# Altium project 1924B_MiniBoiteNoire.PrjPcb
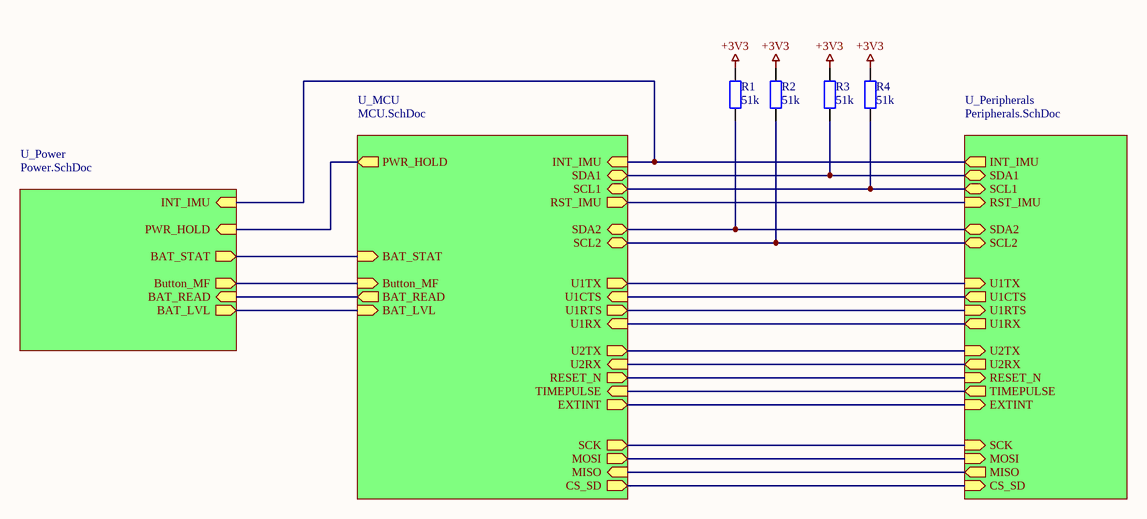
[diagram p0: SchemaBloc.SchDoc]
4 sheets, 111 parts. Net scope: hierarchical (ports join the sheet entries above them; power ports are global).
Board file: ES_Class6C_2L.PcbDoc
Sheets:
  SchemaBloc.SchDoc
    U_MCU = MCU.SchDoc
    U_Power = Power.SchDoc
    U_Peripherals = Peripherals.SchDoc

## Sheet SchemaBloc.SchDoc
size A3; Date: 26.01.2022; Author: Ali Zoubir; CompanyName: ETML-ES; DrawnBy: Ali Zoubir; Engineer: Ali Zoubir; Organization: ETML-ES; Address1: Avenue Recordon 1; Address2: 1004 Lausanne; Address3: Switzerland; Revision: 1924B; SheetNumber: 1; SheetTotal: 4; Version: V0

### Parts
R1  51k  [RES_0805]
R2  51k  [RES_0805]
R3  51k  [RES_0805]
R4  51k  [RES_0805]

### Sub-sheets
U_MCU = MCU.SchDoc: SDA1 (bidir), SCL1 (bidir), CS_SD (out), BAT_STAT (in), RST_IMU (out), INT_IMU (in), PWR_HOLD (out), SDA2 (bidir), SCL2 (bidir), U1TX (out), U1RX (in), MISO (in), MOSI (out), SCK (out), Button_MF (in), BAT_LVL (in), BAT_READ (out), U2TX (out), U1CTS (in), U1RTS (out), U2RX (in), RESET_N (out), EXTINT (out), TIMEPULSE (in)
U_Peripherals = Peripherals.SchDoc: SDA1 (bidir), SCL1 (bidir), RST_IMU (in), INT_IMU (out), U1TX (in), U1CTS (out), U1RTS (in), U1RX (out), SCL2 (bidir), SDA2 (bidir), SCK (in), MOSI (in), MISO (out), CS_SD (in), U2RX (out), U2TX (in), RESET_N (in), EXTINT (in), TIMEPULSE (out)
U_Power = Power.SchDoc: BAT_STAT (out), Button_MF (out), BAT_READ (in), BAT_LVL (out), INT_IMU (in), PWR_HOLD (in)

### Nets
+3V3: R1.2 R2.2 R3.2 R4.2
BAT_LVL: sheet U_MCU/BAT_LVL, sheet U_Power/BAT_LVL
BAT_READ: sheet U_MCU/BAT_READ, sheet U_Power/BAT_READ
BAT_STAT: sheet U_MCU/BAT_STAT, sheet U_Power/BAT_STAT
Button_MF: sheet U_MCU/Button_MF, sheet U_Power/Button_MF
CS_SD: sheet U_MCU/CS_SD, sheet U_Peripherals/CS_SD
EXTINT: sheet U_MCU/EXTINT, sheet U_Peripherals/EXTINT
INT_IMU: sheet U_MCU/INT_IMU, sheet U_Power/INT_IMU, sheet U_Peripherals/INT_IMU
MISO: sheet U_MCU/MISO, sheet U_Peripherals/MISO
MOSI: sheet U_MCU/MOSI, sheet U_Peripherals/MOSI
PWR_HOLD: sheet U_MCU/PWR_HOLD, sheet U_Power/PWR_HOLD
RESET_N: sheet U_MCU/RESET_N, sheet U_Peripherals/RESET_N
RST_IMU: sheet U_MCU/RST_IMU, sheet U_Peripherals/RST_IMU
SCK: sheet U_MCU/SCK, sheet U_Peripherals/SCK
SCL1: R4.1 ; sheet U_MCU/SCL1, sheet U_Peripherals/SCL1
SCL2: R2.1 ; sheet U_MCU/SCL2, sheet U_Peripherals/SCL2
SDA1: R3.1 ; sheet U_MCU/SDA1, sheet U_Peripherals/SDA1
SDA2: R1.1 ; sheet U_MCU/SDA2, sheet U_Peripherals/SDA2
TIMEPULSE: sheet U_MCU/TIMEPULSE, sheet U_Peripherals/TIMEPULSE
U1CTS: sheet U_MCU/U1CTS, sheet U_Peripherals/U1CTS
U1RTS: sheet U_MCU/U1RTS, sheet U_Peripherals/U1RTS
U1RX: sheet U_MCU/U1RX, sheet U_Peripherals/U1RX
U1TX: sheet U_MCU/U1TX, sheet U_Peripherals/U1TX
U2RX: sheet U_MCU/U2RX, sheet U_Peripherals/U2RX
U2TX: sheet U_MCU/U2TX, sheet U_Peripherals/U2TX

### Notes on the sheet
- Fichier :
- a
- Date :
- Heure :
- Version :
- Auteur :
- Modif.
- b
- c
- d
- Projet :
- No :
- Nb feuilles
- Feuille n°
- Chemin :

### Library data of the parts
R1-R4 = Res2: Res 0805; Value: 1k; Published: 8-Jun-2000; LatestRevisionDate: 17-Jul-2002; LatestRevisionNote: Re-released for DXP Platform.; PackageReference: AXIAL-0.4; Publisher: Altium Limited; PackageDescription: Axial Device, Thru-Hole; 2 Leads; 0.4 in Pin Spacing

## Sheet MCU.SchDoc
size A3; Author: Ali Zoubir; Organization: ETML-ES; Address1: Avenue Recordon 1; Address2: 1004 Lausanne; Address3: Switzerland; Revision: 1924B; SheetNumber: 2; SheetTotal: 4; SPICEModelCacheGNAZWADN: <root> / <DocumentId>GNAZWADN</DocumentId> / </root>; Version: V0
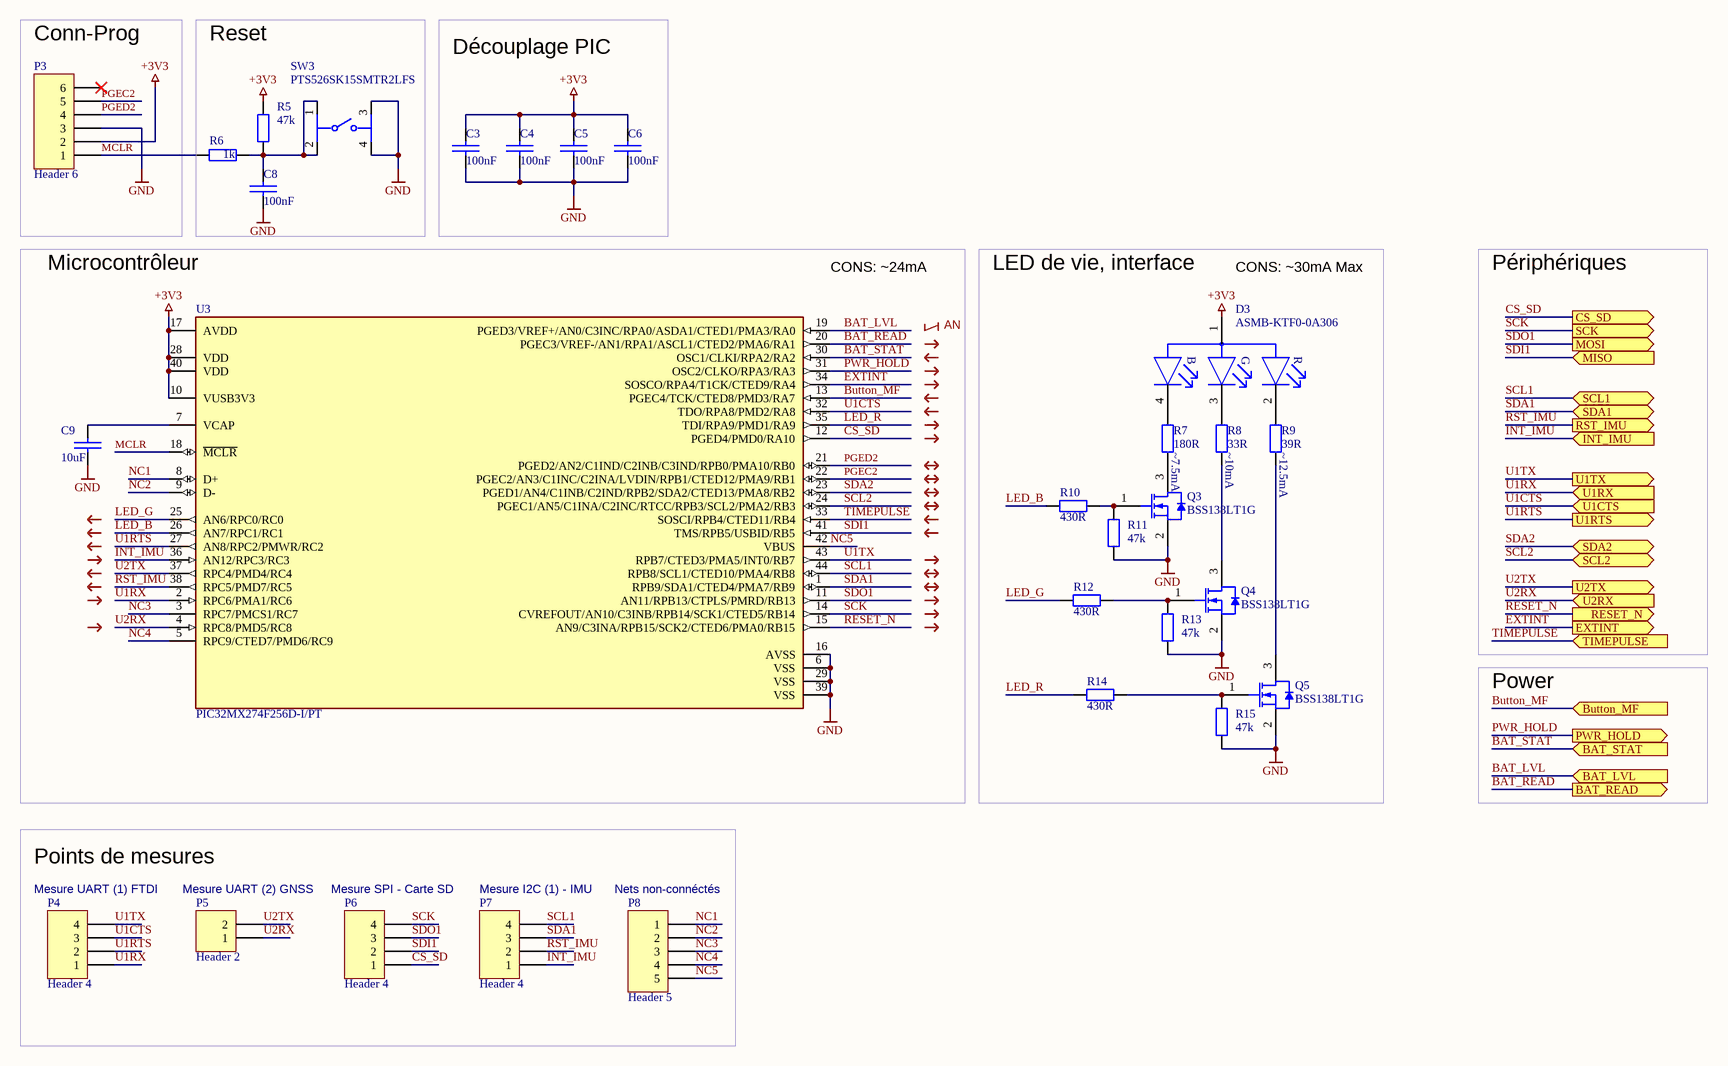
[diagram p1: MCU.SchDoc]

### Parts
C3  100nF  [Cap_0805]
C4  100nF  [Cap_0805]
C5  100nF  [Cap_0805]
C6  100nF  [Cap_0805]
C8  100nF  [Cap_0805]
C9  10uF  [Cap_0805]
D3  ASMB-KTF0-0A306  [FP-PLCC-4-MFG]
P3  Header 6  [HDR1X6]
P4  Header 4  [HDR1X4]
P5  Header 2  [HDR1X2]
P6  Header 4  [HDR1X4]
P7  Header 4  [HDR1X4]
P8  Header 5  [HDR1X5]
Q3  BSS138LT1G  [ONSC-SOT-23-3-318-08_V]
Q4  BSS138LT1G  [ONSC-SOT-23-3-318-08_V]
Q5  BSS138LT1G  [ONSC-SOT-23-3-318-08_V]
R5  47k  [RES_0805]
R6  1k  [RES_0805]
R7  value 180R  [RES_0805]  (hidden comment: 430R)
R8  value 33R  [RES_0805]  (hidden comment: 430R)
R9  value 39R  [RES_0805]  (hidden comment: 430R)
R10  430R  [RES_0805]
R11  value 47k  [RES_0805]  (hidden comment: 10k)
R12  430R  [RES_0805]
R13  value 47k  [RES_0805]  (hidden comment: 10k)
R14  430R  [RES_0805]
R15  value 47k  [RES_0805]  (hidden comment: 10k)
SW3  PTS526SK15SMTR2LFS  [FP-PTS526SK15SMTR2LFS-MFG]
U3  PIC32MX274F256D-I/PT  [FP-C04-076-IPC_A]

### Blocks framed on the sheet
Conn-Prog: P3
Reset: C8 R5 R6 SW3
Découplage PIC: C3-C6
Microcontrôleur: C9 U3
LED de vie, interface: D3 Q3-Q5 R7-R15
Points de mesures: P4-P8

### Ports
BAT_LVL (in), BAT_READ (out), BAT_STAT (in), Button_MF (in), CS_SD (out), EXTINT (out), INT_IMU (in), MISO (in), MOSI (out), PWR_HOLD (out), RESET_N (out), RST_IMU (out), SCK (out), SCL1 (bidir), SCL2 (bidir), SDA1 (bidir), SDA2 (bidir), TIMEPULSE (in), U1CTS (in), U1RTS (out), U1RX (in), U1TX (out), U2RX (in), U2TX (out)

### Nets
+3V3: C3.1 C4.1 C5.1 C6.1 D3.1(A) P3.2 R5.1 U3.10(VUSB3V3) U3.17(AVDD) U3.28(VDD) U3.40(VDD)
GND: C3.2 C4.2 C5.2 C6.2 C8.2 C9.2 P3.3 Q3.2(S) Q4.2(S) Q5.2(S) R11.1 R13.1 R15.1 SW3.3 SW3.4 U3.6(VSS) U3.16(AVSS) U3.29(VSS) U3.39(VSS)
BAT_LVL: U3.19(PGED3/VREF+/AN0/C3INC/RPA0/ASDA1/CTED1/PMA3/RA0) ; port BAT_LVL
BAT_READ: U3.20(PGEC3/VREF-/AN1/RPA1/ASCL1/CTED2/PMA6/RA1) ; port BAT_READ
BAT_STAT: U3.30(OSC1/CLKI/RPA2/RA2) ; port BAT_STAT
Button_MF: U3.13(PGEC4/TCK/CTED8/PMD3/RA7) ; port Button_MF
CS_SD: P6.1 U3.12(PGED4/PMD0/RA10) ; port CS_SD
EXTINT: U3.34(SOSCO/RPA4/T1CK/CTED9/RA4) ; port EXTINT
INT_IMU: P7.1 U3.36(AN12/RPC3/RC3) ; port INT_IMU
LED_B: R10.2 U3.26(AN7/RPC1/RC1)
LED_G: R12.2 U3.25(AN6/RPC0/RC0)
LED_R: R14.2 U3.35(TDI/RPA9/PMD1/RA9)
MCLR: P3.1 R6.1 U3.18(~{MCLR})
NC1: P8.1 U3.8(D+)
NC2: P8.2 U3.9(D-)
NC3: P8.3 U3.3(RPC7/PMCS1/RC7)
NC4: P8.4 U3.5(RPC9/CTED7/PMD6/RC9)
NC5: P8.5 U3.42(VBUS)
PGEC2: P3.5 U3.22(PGEC2/AN3/C1INC/C2INA/LVDIN/RPB1/CTED12/PMA9/RB1)
PGED2: P3.4 U3.21(PGED2/AN2/C1IND/C2INB/C3IND/RPB0/PMA10/RB0)
PWR_HOLD: U3.31(OSC2/CLKO/RPA3/RA3) ; port PWR_HOLD
RESET_N: U3.15(AN9/C3INA/RPB15/SCK2/CTED6/PMA0/RB15) ; port RESET_N
RST_IMU: P7.2 U3.38(RPC5/PMD7/RC5) ; port RST_IMU
SCK: P6.4 U3.14(CVREFOUT/AN10/C3INB/RPB14/SCK1/CTED5/RB14) ; port SCK
SCL1: P7.4 U3.44(RPB8/SCL1/CTED10/PMA4/RB8) ; port SCL1
SCL2: U3.24(PGEC1/AN5/C1INA/C2INC/RTCC/RPB3/SCL2/PMA2/RB3) ; port SCL2
SDA1: P7.3 U3.1(RPB9/SDA1/CTED4/PMA7/RB9) ; port SDA1
SDA2: U3.23(PGED1/AN4/C1INB/C2IND/RPB2/SDA2/CTED13/PMA8/RB2) ; port SDA2
SDI1: P6.2 U3.41(TMS/RPB5/USBID/RB5) ; port MISO  [project net MISO]
SDO1: P6.3 U3.11(AN11/RPB13/CTPLS/PMRD/RB13) ; port MOSI  [project net MOSI]
TIMEPULSE: U3.33(SOSCI/RPB4/CTED11/RB4) ; port TIMEPULSE
U1CTS: P4.3 U3.32(TDO/RPA8/PMD2/RA8) ; port U1CTS
U1RTS: P4.2 U3.27(AN8/RPC2/PMWR/RC2) ; port U1RTS
U1RX: P4.1 U3.2(RPC6/PMA1/RC6) ; port U1RX
U1TX: P4.4 U3.43(RPB7/CTED3/PMA5/INT0/RB7) ; port U1TX
U2RX: P5.1 U3.4(RPC8/PMD5/RC8) ; port U2RX
U2TX: P5.2 U3.37(RPC4/PMD4/RC4) ; port U2TX
NetC8_1: C8.1 R5.2 R6.2 SW3.1 SW3.2
NetC9_1: C9.1 U3.7(VCAP)
NetD3_2: D3.2(Red_C) R9.1
NetD3_3: D3.3(Green_C) R8.1
NetD3_4: D3.4(Blue_C) R7.1
NetQ3_1: Q3.1(G) R10.1 R11.2
NetQ3_3: Q3.3(D) R7.2
NetQ4_1: Q4.1(G) R12.1 R13.2
NetQ4_3: Q4.3(D) R8.2
NetQ5_1: Q5.1(G) R14.1 R15.2
NetQ5_3: Q5.3(D) R9.2

Not connected (* = marked no-connect by the designer): P3 6*

### Notes on the sheet
- CONS: ~24mA
- CONS: ~30mA Max
- Périphériques
- AN
- ~7.5mA
- (near R8) ~10mA
- (near R9) ~12.5mA
- Power
- (near P4) Mesure UART (1) FTDI
- (near P5) Mesure UART (2) GNSS
- (near P6) Mesure SPI - Carte SD
- (near P7) Mesure I2C (1) - IMU
- (near P8) Nets non-connéctés
- Fichier :
- a
- Date :
- Heure :
- Version :
- Auteur :
- Modif.
- b
- c
- d
- Projet :
- No :
- Nb feuilles
- Feuille n°
- Chemin :
- (in symbol CMP-18399-000003-1) B; G; R

### Library data of the parts
C3-C6 C8 C9 = C: SDTSourceLibName: C:\WINDOWS\TEMP\DA.LIB; PCB Footprint: RC0805
D3 = CMP-18399-000003-1: LED RGB 4PLCC SMD; Manufacturer: Broadcom; Peak Emmision Wavelength: 467/518/628nm; Luminous Intensity: 215/1100/490mcd; Power Dissipation: 66/66/48mW; Led Orientation: Top View; Colour: Blue, Green, Red; Wavelength: 471/524/620nm; Forward Current: 10/15/15mA; Reverse Voltage: 4V; Viewing Angle: 110°; Forward Voltage: 2.85/2.95/2V; Max Junction Temp: +100°C; Digikey Description: LED RGB 4PLCC SMD; ComponentLink2URL: https://docs.broadcom.com/docs/ASMB-KTF0-0A306-DS100; ComponentLink2Description: Datasheet; Manufacturer Part Number: ASMB-KTF0-0A306; Temperature Range Low: -40°C; Device Class L2: LEDs; RoHS: TRUE; Octopart: https://octopart.com/asmb-ktf0-0a306-broadcom-87157377; Package: PLCC-4; Mouser Description: LED Multi-Color Chip Red/Green/Blue 620nm/524nm/471nm 20mA 4-Pin PLCC T/R; Category: Diode; Lead Free: Yes; Height: 2.1mm; Temperature: -40°C to +85°C; Device Class L1: Optoelectronics; Automotive: No; Temperature Range High: +85°C; Device Class L3: unset
P3 = Header 6: Header, 6-Pin; LatestRevisionDate: 17-Jul-2002; LatestRevisionNote: Re-released for DXP Platform.; Publisher: Altium Limited
P4 P6 P7 = Header 4: Header, 4-Pin; LatestRevisionDate: 17-Jul-2002; LatestRevisionNote: Re-released for DXP Platform.; Publisher: Altium Limited
P5 = Header 2: Header, 2-Pin; LatestRevisionDate: 17-Jul-2002; LatestRevisionNote: Re-released for DXP Platform.; Publisher: Altium Limited
P8 = Header 5: Header, 5-Pin; LatestRevisionDate: 17-Jul-2002; LatestRevisionNote: Re-released for DXP Platform.; Publisher: Altium Limited
Q3-Q5 = CMP-1058-00767-1: Power MOSFET, 200 mA, 50 V, N-Channel, 3-Pin SOT-23, Pb-Free, Tape and Reel; Manufacturer: On Semiconductor; PD Max (W): 0.225; Coss Typ (pF): 12; V(BR)DSS Min (V): 50; VGS Max (V): 20; Channel Polarity: N Channel; Configuration: Single; VGS(th) Max (V): 1.5; Ciss Typ (pF): 40; Crss Typ (pF): 3.5; ID Max (A): 0.2; ComponentLink3Description: Package Specification; PackageDescription: 3-Pin Small Outline Transistor, Body 2.92 x 1.3 mm, Pitch 0.95 mm; PackageReference: SOT-23-3-318-08; RoHS: Pb-Free; Mounting Technology: Surface Mount; ComponentLink1Description: Manufacturer URL; ComponentLink2URL: http://www.onsemi.com/pub_link/Collateral/BSS138LT1-D.PDF; ComponentLink2Description: Datasheet; Packing: Tape and Reel; PackageVersion: Rev. AP, 11/2009; PartNumber: BSS138LT1G; Package Type: SOT-23-3; ComponentLink1URL: http://www.onsemi.com/; DatasheetVersion: Rev. 8; ComponentLink3URL: http://www.onsemi.cn/pub_link/Collateral/318-08.PDF
R5 = Res2: Res 0805; Value: 1K; Published: 8-Jun-2000; LatestRevisionDate: 17-Jul-2002; LatestRevisionNote: Re-released for DXP Platform.; PackageReference: AXIAL-0.4; Publisher: Altium Limited; PackageDescription: Axial Device, Thru-Hole; 2 Leads; 0.4 in Pin Spacing
R6-R15 = Res2: Res 0805; Published: 8-Jun-2000; LatestRevisionDate: 17-Jul-2002; LatestRevisionNote: Re-released for DXP Platform.; PackageReference: AXIAL-0.4; Publisher: Altium Limited; PackageDescription: Axial Device, Thru-Hole; 2 Leads; 0.4 in Pin Spacing
  R6: Value: 1K
  R10 R12 R14: Value: 430R
SW3 = CMP-10040-000013-1: TACT 5.2 X 5.2, 1.5 MM H, 260GF,; Manufacturer: C&K; Operating Force: 250gf; Throw Configuration: SPST-NO; Contact Current Rating: 50mA; Standoff Height: 0mm; Contact Resistance: 100mΩ; Voltage Rating Dc: 12V; Electromechanical Life: 200000Cycles; Device Class L3: Tactile Switches; Device Class L2: Switches; Temperature: -20°C to +70°C; Temperature Range Low: -20°C; Package: PTS526SK15SMTR2LFS; Temperature Range High: +70°C; ComponentLink2Description: Datasheet; Device Class L1: Electromechanical; Height: 1.65mm; Digikey Description: TACT 5.2 X 5.2, 1.5 MM H, 260GF,; Category: Switch; RoHS: TRUE; Automotive: No; Lead Free: Yes; Manufacturer Part Number: PTS526SK15SMTR2LFS; Octopart: https://octopart.com/pts526+sk15+smtr2+lfs-c%26k+components-100617999; ComponentLink2URL: https://www.ckswitches.com/media/2780/pts526.pdf
U3 = CMP-06276-000357-1: IC MCU 32BIT 256KB FLASH 44TQFP

## Sheet Power.SchDoc
size A3; Author: Ali Zoubir; Organization: ETML-ES; Address1: Avenue Recordon 1; Address2: 1004 Lausanne; Address3: Switzerland; Revision: 1924B; SheetNumber: 4; SheetTotal: 4; Version: V0
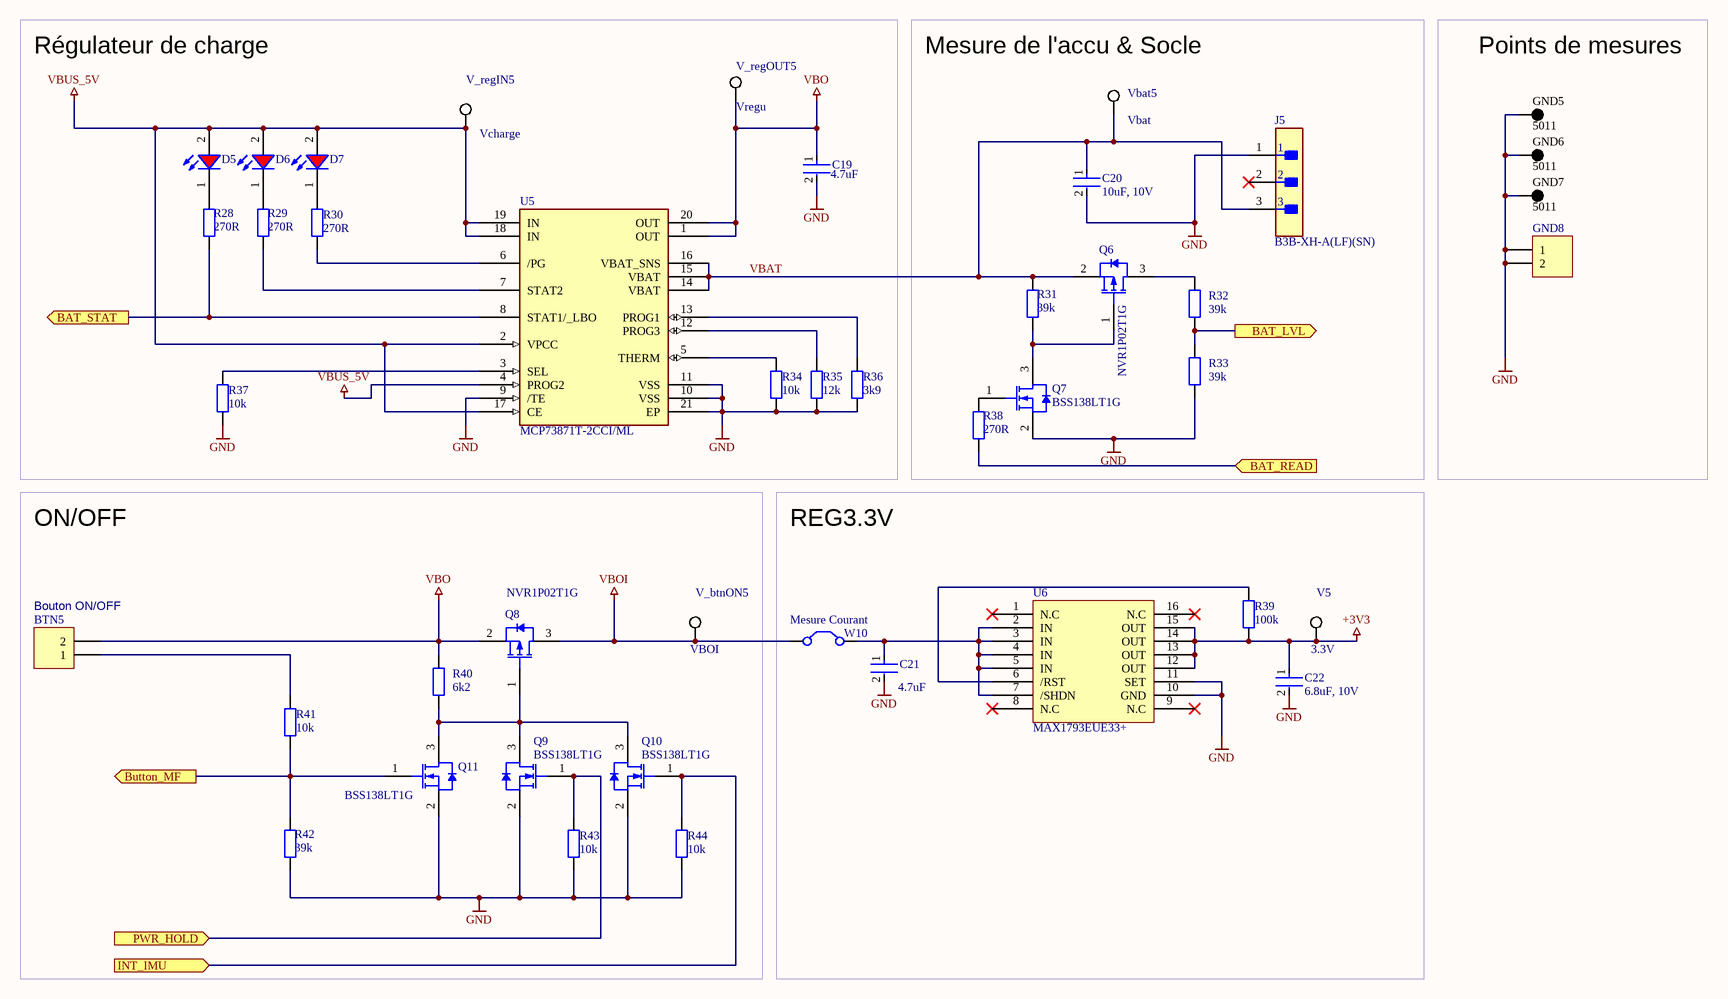
[diagram p2: Power.SchDoc]

### Parts
BTN5  Button connector  [HDR1X2]  (value not drawn)
C19  Capacitance: 4.7uF  [Cap_0805]  (hidden comment: 4.7uF, 35V)
C20  10uF, 10V  [Cap_0805]
C21  Capacitance: 4.7uF  [Cap_0805]  (hidden comment: 4.7uF, 35V)
C22  6.8uF, 10V  [Cap_0805]
D5  Super Red, 1.9 V  [WL-SMCW_0805_150080xx75000]  (value not drawn)
D6  Super Red, 1.9 V  [WL-SMCW_0805_150080xx75000]  (value not drawn)
D7  Super Red, 1.9 V  [WL-SMCW_0805_150080xx75000]  (value not drawn)
GND5  5011  [KSTN-5011_V]
GND6  5011  [KSTN-5011_V]
GND7  5011  [KSTN-5011_V]
GND8  Header 2  [HDR1X2]  (value not drawn)
J5  B3B-XH-A(LF)(SN)  [FP-B3B-XH-A_LF_SN-MFG]
Q6  NVR1P02T1G  [ONSC-SOT-23-3-318-08_V]
Q7  BSS138LT1G  [ONSC-SOT-23-3-318-08_V]
Q8  NVR1P02T1G  [ONSC-SOT-23-3-318-08_V]
Q9  BSS138LT1G  [ONSC-SOT-23-3-318-08_V]
Q10  BSS138LT1G  [ONSC-SOT-23-3-318-08_V]
Q11  BSS138LT1G  [ONSC-SOT-23-3-318-08_V]
R28  270R  [RES_0805]
R29  270R  [RES_0805]
R30  270R  [RES_0805]
R31  39k  [RES_0805]
R32  39k  [RES_0805]
R33  39k  [RES_0805]
R34  10k  [RES_0805]
R35  12k  [RES_0805]
R36  3k9  [RES_0805]
R37  10k  [RES_0805]
R38  270R  [RES_0805]
R39  100k  [RES_0805]
R40  6k2  [RES_0805]
R41  10k  [RES_0805]
R42  39k  [RES_0805]
R43  10k  [RES_0805]
R44  10k  [RES_0805]
U5  MCP73871T-2CCI/ML  [Microchip_C04-126_IPC_B]
U6  MAX1793EUE33+  [TSOP65P640X110_HS-17N]
V5  3.3V  [KSTN-5019_V]
V_btnON5  VBOI  [KSTN-5019_V]
V_regIN5  Vcharge  [KSTN-5019_V]
V_regOUT5  Vregu  [KSTN-5019_V]
Vbat5  Vbat  [KSTN-5019_V]
W10  Jumper  [JUMPER]  (value not drawn)

### Blocks framed on the sheet
Régulateur de charge: C19 D5-D7 R28-R30 R34-R37 U5 V_regIN5 V_regOUT5
Mesure de l'accu & Socle: C20 J5 Q6 Q7 R31-R33 R38 Vbat5
Points de mesures: GND5-GND8
ON/OFF: BTN5 Q8-Q11 R40-R44 V_btnON5
REG3.3V: C21 C22 R39 U6 V5 W10

### Ports
BAT_LVL (out), BAT_READ (in), BAT_STAT (out), Button_MF (out), INT_IMU (in), PWR_HOLD (in)

### Nets
+3V3: C22.1 R39.1 U6.12(OUT) U6.13(OUT) U6.14(OUT) U6.15(OUT) V5.1
GND: C19.2 C20.2 C21.2 C22.2 GND5.1 GND6.1 GND7.1 GND8.1 GND8.2 J5.1 Q7.2(S) Q9.2(S) Q10.2(S) Q11.2(S) R33.1 R34.1 R35.1 R36.1 R37.1 R42.1 R43.1 R44.1 U5.9(/TE) U5.10(VSS) U5.11(VSS) U5.21(EP) U6.10(GND) U6.11(SET)
VBO: BTN5.2 C19.1 Q8.2(S) R40.2 U5.1(OUT) U5.20(OUT) V_regOUT5.1
VBOI: Q8.3(D) V_btnON5.1 W10.1(C1)
VBUS_5V: D5.2(A) D6.2(A) D7.2(A) U5.2(VPCC) U5.4(PROG2) U5.17(CE) U5.18(IN) U5.19(IN) V_regIN5.1
BAT_LVL: R32.1 R33.2 ; port BAT_LVL
BAT_READ: R38.1 ; port BAT_READ
BAT_STAT: R28.1 U5.8(STAT1/_LBO) ; port BAT_STAT
Button_MF: Q11.1(G) R41.1 R42.2 ; port Button_MF
INT_IMU: Q10.1(G) R44.2 ; port INT_IMU
PWR_HOLD: Q9.1(G) R43.2 ; port PWR_HOLD
VBAT: C20.1 J5.3 Q6.2(S) R31.2 U5.14(VBAT) U5.15(VBAT) U5.16(VBAT_SNS) Vbat5.1
NetBTN5_1: BTN5.1 R41.2
NetC21_1: C21.1 U6.2(IN) U6.3(IN) U6.4(IN) U6.5(IN) U6.7(/SHDN) W10.2(C2)
NetD5_1: D5.1(K) R28.2
NetD6_1: D6.1(K) R29.2
NetD7_1: D7.1(K) R30.1
NetQ6_1: Q6.1(G) Q7.3(D) R31.1
NetQ6_3: Q6.3(D) R32.2
NetQ7_1: Q7.1(G) R38.2
NetQ8_1: Q8.1(G) Q9.3(D) Q10.3(D) Q11.3(D) R40.1
NetR29_1: R29.1 U5.7(STAT2)
NetR30_2: R30.2 U5.6(/PG)
NetR34_2: R34.2 U5.5(THERM)
NetR35_2: R35.2 U5.12(PROG3)
NetR36_2: R36.2 U5.13(PROG1)
NetR37_2: R37.2 U5.3(SEL)
NetR39_2: R39.2 U6.6(/RST)

Not connected (* = marked no-connect by the designer): J5 2*; U6 1(N.C)* 8(N.C)* 9(N.C)* 16(N.C)*

### Notes on the sheet
- (near BTN5) Bouton ON/OFF
- (near W10) Mesure Courant
- Fichier :
- a
- Date :
- Heure :
- Version :
- Auteur :
- Modif.
- b
- c
- d
- Projet :
- No :
- Nb feuilles
- Feuille n°
- Chemin :

### Library data of the parts
BTN5 GND8 = Header 2: Header, 2-Pin; LatestRevisionDate: 17-Jul-2002; LatestRevisionNote: Re-released for DXP Platform.; Publisher: Altium Limited
C19 C21 = CMP-08246-002735-1: Multilayer Ceramic Capacitors 4.7μF ±10% 35V X7R SMD 0805; Tolerance: 10%; Depth: 1.25mm; RoHS Compliant: Yes; Construction: Flat; Radiation Hardening: No; Lead Free: Lead Free; Weight: 0.000194oz; Termination: SMD/SMT; Package Quantity: 2000; Dielectric: X7R; Mount: Surface Mount; Voltage Rating: 35V; Case/Package: 0805; Min Operating Temperature: -55°C; Dielectric Material: Ceramic; REACH SVHC: No SVHC; Series: C; Thickness: 0.057inch; Packaging: Tape and Reel; Case Code (Metric): 2012; Max Operating Temperature: 125°C; Case Code (Imperial): 0805; Height: 1.25mm; Width: 0.049inch; Length: 2mm; Voltage Rating (DC): 35V
C20 = CMP-2007-03243-2: CAP CER 10UF 10V X5R 0805; Manufacturer Part Number: C0805C106K8PACTU; Manufacturer: Kemet; 3DS Part Number: 220-00001; Tolerance: 10%; Temperature Coefficient: 15%; Material: Ceramic; Device Class L2: Capacitors; Device Class L1: Passive Components; ComponentLink2URL: https://content.kemet.com/datasheets/KEM_C1006_X5R_SMD.pdf; Height: 1.4mm; Lead Free: Yes; Digikey Description: CAP CER 10UF 10V X5R 0805; Octopart: https://octopart.com/c0805c106k8pactu-kemet-98697; Capacitance: 10uF; Value: 10uF; Temperature Range Low: -55°C; Temperature: -55°C to +85°C; Automotive: No; Mouser Description: CAP CER 10UF 10V X5R 0805; Ipc Land Pattern Name: CAPC200125X125; Temperature Range High: +85°C; Voltage: 10V; RoHS: TRUE; Device Class L3: Ceramic Capacitors; ComponentLink2Description: Datasheet; Voltage Rating: 10V; Package: C0805C-DG; Temperature Characteristic: X5R; Category: Cap
C22 = CMP-08246-000118-1: Cap Ceramic 6.8uF 10V X5R 20% Pad SMD 0805 +85°C Automotive T/R; Capacitance: 6.8uF; Packaging: Tape and Reel; Package Quantity: 2000; Width: 0.049inch; Voltage Rating (DC): 10V; Case Code (Imperial): 0805; Ratings: AEC-Q200; Min Operating Temperature: -55°C; Tolerance: 20%; Length: 0.079inch; Case/Package: 0805; Thickness: 0.057inch; Weight: 0.000194oz; Voltage Rating: 10V; Dielectric: X5R; Case Code (Metric): 2012; Height: 1.25mm; Max Operating Temperature: 85°C; Mount: Surface Mount
D5-D7 = 150080SS75000: SMT Mono-color Chip LED Waterclear WL-SMCW, size 0805, Super Red, 1.9 V, 140 deg, 60 mcd; Forward Voltage: 1.9 V; Viewing Angle: 140 deg; Peak Wavelength: 645 nm; Dominant Wavelength: 630 nm; Luminous Intensity: 60 mcd; Chip Technology: AlInGaP; ComponentLink1Description: Manufacturer; ComponentLink1URL: http://www.we-online.de; ComponentLink2Description: Datasheet; ComponentLink2URL: https://katalog.we-online.de/led/datasheet/150080SS75000.pdf; Part Number: 150080SS75000; Published Date: November 2018; Publisher: Wurth Elektronik; Size: 0805; Operating Temperature: -40 to 85 degC; Emitting Color: Super Red; Mounting Technology: SMT; Packaging: Tape and Reel; Supplier 1: Digi-Key; Supplier Part Number 1: 732-4985-1-ND; Supplier 2: Distrelec; Supplier Part Number 2: 30008875
GND5-GND7 = CMP-1672-00003-4: Test Point, Black, Through Hole, RoHS, Bulk; Manufacturer: Keystone; ComponentLink2URL: http://www.keyelco.com/product-pdf.cfm?p=1320; Colour: Black; Pins: 1; REACH SVHC: No SVHC; ComponentLink1URL: http://www.keyelco.com/; PackageReference: 5011; Contact Plating: Silver; Package Quantity: 100; Packaging: Bulk; RoHSCompliant: true; Height: 8.12 mm; PackageDescription: 1-Pin Through Hole Device, Dia 3.17 mm; Mount: Through Hole; Mounting Technology: Through Hole; DatasheetVersion: Rev. F, 12/2013; ComponentLink1Description: Manufacturer URL; Contact Material: Bronze; ComponentLink2Description: Datasheet
J5 = CMP-17439-000014-3: CONN HEADER VERT 3POS 2.5MM; Max Voltage Rating (DC): 250V; Number of Positions: 3; Current Rating: 3A; Gender: Male; Wire/Cable Gauge: 22AWG; Contact Resistance: 20mR; Insulation Resistance: 1GR; Insulation Material: Nylon; Contact Plating: Tin; Depth: 5.75mm; Contact Type: Male Pin; Max Operating Temperature: 85°C; Insulation Color: Natural; Voltage Rating (AC): 250V; Color: Natural; Connector Type: Header; Orientation: Straight; Fastening Type: Detent; Housing Color: White; Min Operating Temperature: -25°C; Termination: Solder; Voltage Rating: 250V; Series: XH; Pitch: 2.5mm; Contact Shape: Square; Number of Rows: 1; Lead Free: Lead Free; Packaging: Bulk; Mount: Through Hole; Flammability Rating: UL94 V-0; Max Voltage Rating (AC): 250V; REACH SVHC: No SVHC; Housing Material: Polyamide; Contact Material: Brass; Lead Pitch: 2.5mm; Contact Finish - Mating: TIN; Length: 9.9mm; Max Current Rating: 3A; Number of Contacts: 3
Q6 Q8 = CMP-1058-00745-1: Power MOSFET, -20 V, -1 A, P-Channel, 3-Pin SOT-23, Pb-Free, Tape and Reel; Manufacturer: On Semiconductor; Ciss Typ (pF): 165; Configuration: Single; VGS(th) Max (V): 2.3; Channel Polarity: P Channel; V(BR)DSS Min (V): 20; ID Max (A): 1; Coss Typ (pF): 110; Qrr Typ (nC): 8; Crss Typ (pF): 35; PD Max (W): 0.4; DatasheetVersion: Rev. 7; ComponentLink1Description: Manufacturer URL; PackageReference: SOT-23-3-318-08; ComponentLink2Description: Datasheet; ComponentLink2URL: http://www.onsemi.cn/pub_link/Collateral/NTR1P02T1-D.PDF; Packing: Tape and Reel; Package Type: SOT-23-3; ComponentLink1URL: http://www.onsemi.com/; RoHS: Pb-Free; PartNumber: NVR1P02T1G; PackageVersion: Rev. AP, 11/2009; PackageDescription: 3-Pin Small Outline Transistor, Body 2.92 x 1.3 mm, Pitch 0.95 mm; ComponentLink3URL: http://www.onsemi.cn/pub_link/Collateral/318-08.PDF; ComponentLink3Description: Package Specification; VGS Max (V): 20; Mounting Technology: Surface Mount
Q7 Q9-Q11 = CMP-1058-00767-1: as Q3 on sheet MCU; ComponentLink3Description: Package Specification; PackageDescription: 3-Pin Small Outline Transistor, Body 2.92 x 1.3 mm, Pitch 0.95 mm; PackageReference: SOT-23-3-318-08; RoHS: Pb-Free; Mounting Technology: Surface Mount; ComponentLink1Description: Manufacturer URL; ComponentLink2URL: http://www.onsemi.com/pub_link/Collateral/BSS138LT1-D.PDF; ComponentLink2Description: Datasheet; Packing: Tape and Reel; PackageVersion: Rev. AP, 11/2009; PartNumber: BSS138LT1G; Package Type: SOT-23-3; ComponentLink1URL: http://www.onsemi.com/; DatasheetVersion: Rev. 8; ComponentLink3URL: http://www.onsemi.cn/pub_link/Collateral/318-08.PDF
R28-R30 R38 = CMP-2001-00528-1: Res 0805; Part Number: ERJ6ENF2703V; Manufacturer: Panasonic
R31-R33 R42 = CMP-2001-00410-1: Res 0805; Part Number: ERJ-6GEYJ393V; Manufacturer: Panasonic
R34 R37 R41 R43 R44 = CMP-2001-04376-1: Res 0805; Manufacturer: Panasonic; Part Number: ERJ-6ENF1002V
R35 = CMP-2001-04031-1: Res 0805; Manufacturer: Vishay Dale; Part Number: CRCW08055K60JNEA
R36 = CMP-1013-00510-2: Res 0805; Part Number: CRCW08051K00FKEA; Manufacturer: Vishay Dale
R39 = CMP-2001-00479-1: Res 0805; Manufacturer: Panasonic; Part Number: ERJ-P06J104V
R40 = CMP-2001-00562-1: Res 0805; Part Number: ERJ6ENF6201V; Manufacturer: Panasonic
U5 = MCP73871T-2CCI/ML: Charger IC Lithium Ion/Polymer 20-QFN _4x4_; MF: Microchip; SnapEDA_Link: https://www.snapeda.com/parts/MCP73871T-2CCI/ML/Microchip/view-part/1049920/?ref=snap; Value: *; Digi-Key_Part_Number: MCP73871T-2CCI/MLCT-ND; MP: MCP73871T-2CCI/ML; Digi-Key_Purchase_URL: https://www.digikey.com/product-detail/en/microchip-technology/MCP73871T-2CCI-ML/MCP73871T-2CCI-MLCT-ND/7065594?utm_source=snapeda&utm_medium=aggregator&utm_campaign=symbol; Package: QFN-20 Microchip
V5 V_btnON5 V_regIN5 V_regOUT5 Vbat5 = CMP-1672-00008-1: Test Point, 1 Position SMD, RoHS, Tape and Reel; ComponentLink1Description: Manufacturer URL; Package Quantity: 1000; DatasheetVersion: 03/2014; Packaging: Tape and Reel; ComponentLink2URL: http://www.keyelco.com/product-pdf.cfm?p=1357; ComponentLink1URL: http://www.keyelco.com/; Mount: Surface Mount; Contact Plating: Silver; PackageDescription: 1-Pin Surface Mount Device, Body 3.81 x 2.03 mm; Pins: 1; RoHSCompliant: True; Mounting Technology: Surface Mount; ComponentLink2Description: Datasheet; PackageReference: 5019
W10 = Jumper: Jumper Wire; Published: 24-Mar-1999; LatestRevisionDate: 17-Jul-2002; LatestRevisionNote: Re-released for DXP Platform.; PackageReference: RAD-0.2; Publisher: Altium Limited; PackageDescription: Radial Cap, Thru-Hole; 2 Leads; 0.2 in Pin Spacing

## Sheet Peripherals.SchDoc
size A3; Author: Ali Zoubir; Organization: ETML-ES; Address1: Avenue Recordon 1; Address2: 1004 Lausanne; Address3: Switzerland; Revision: 1924B; SheetNumber: 3; SheetTotal: 4; Version: V0
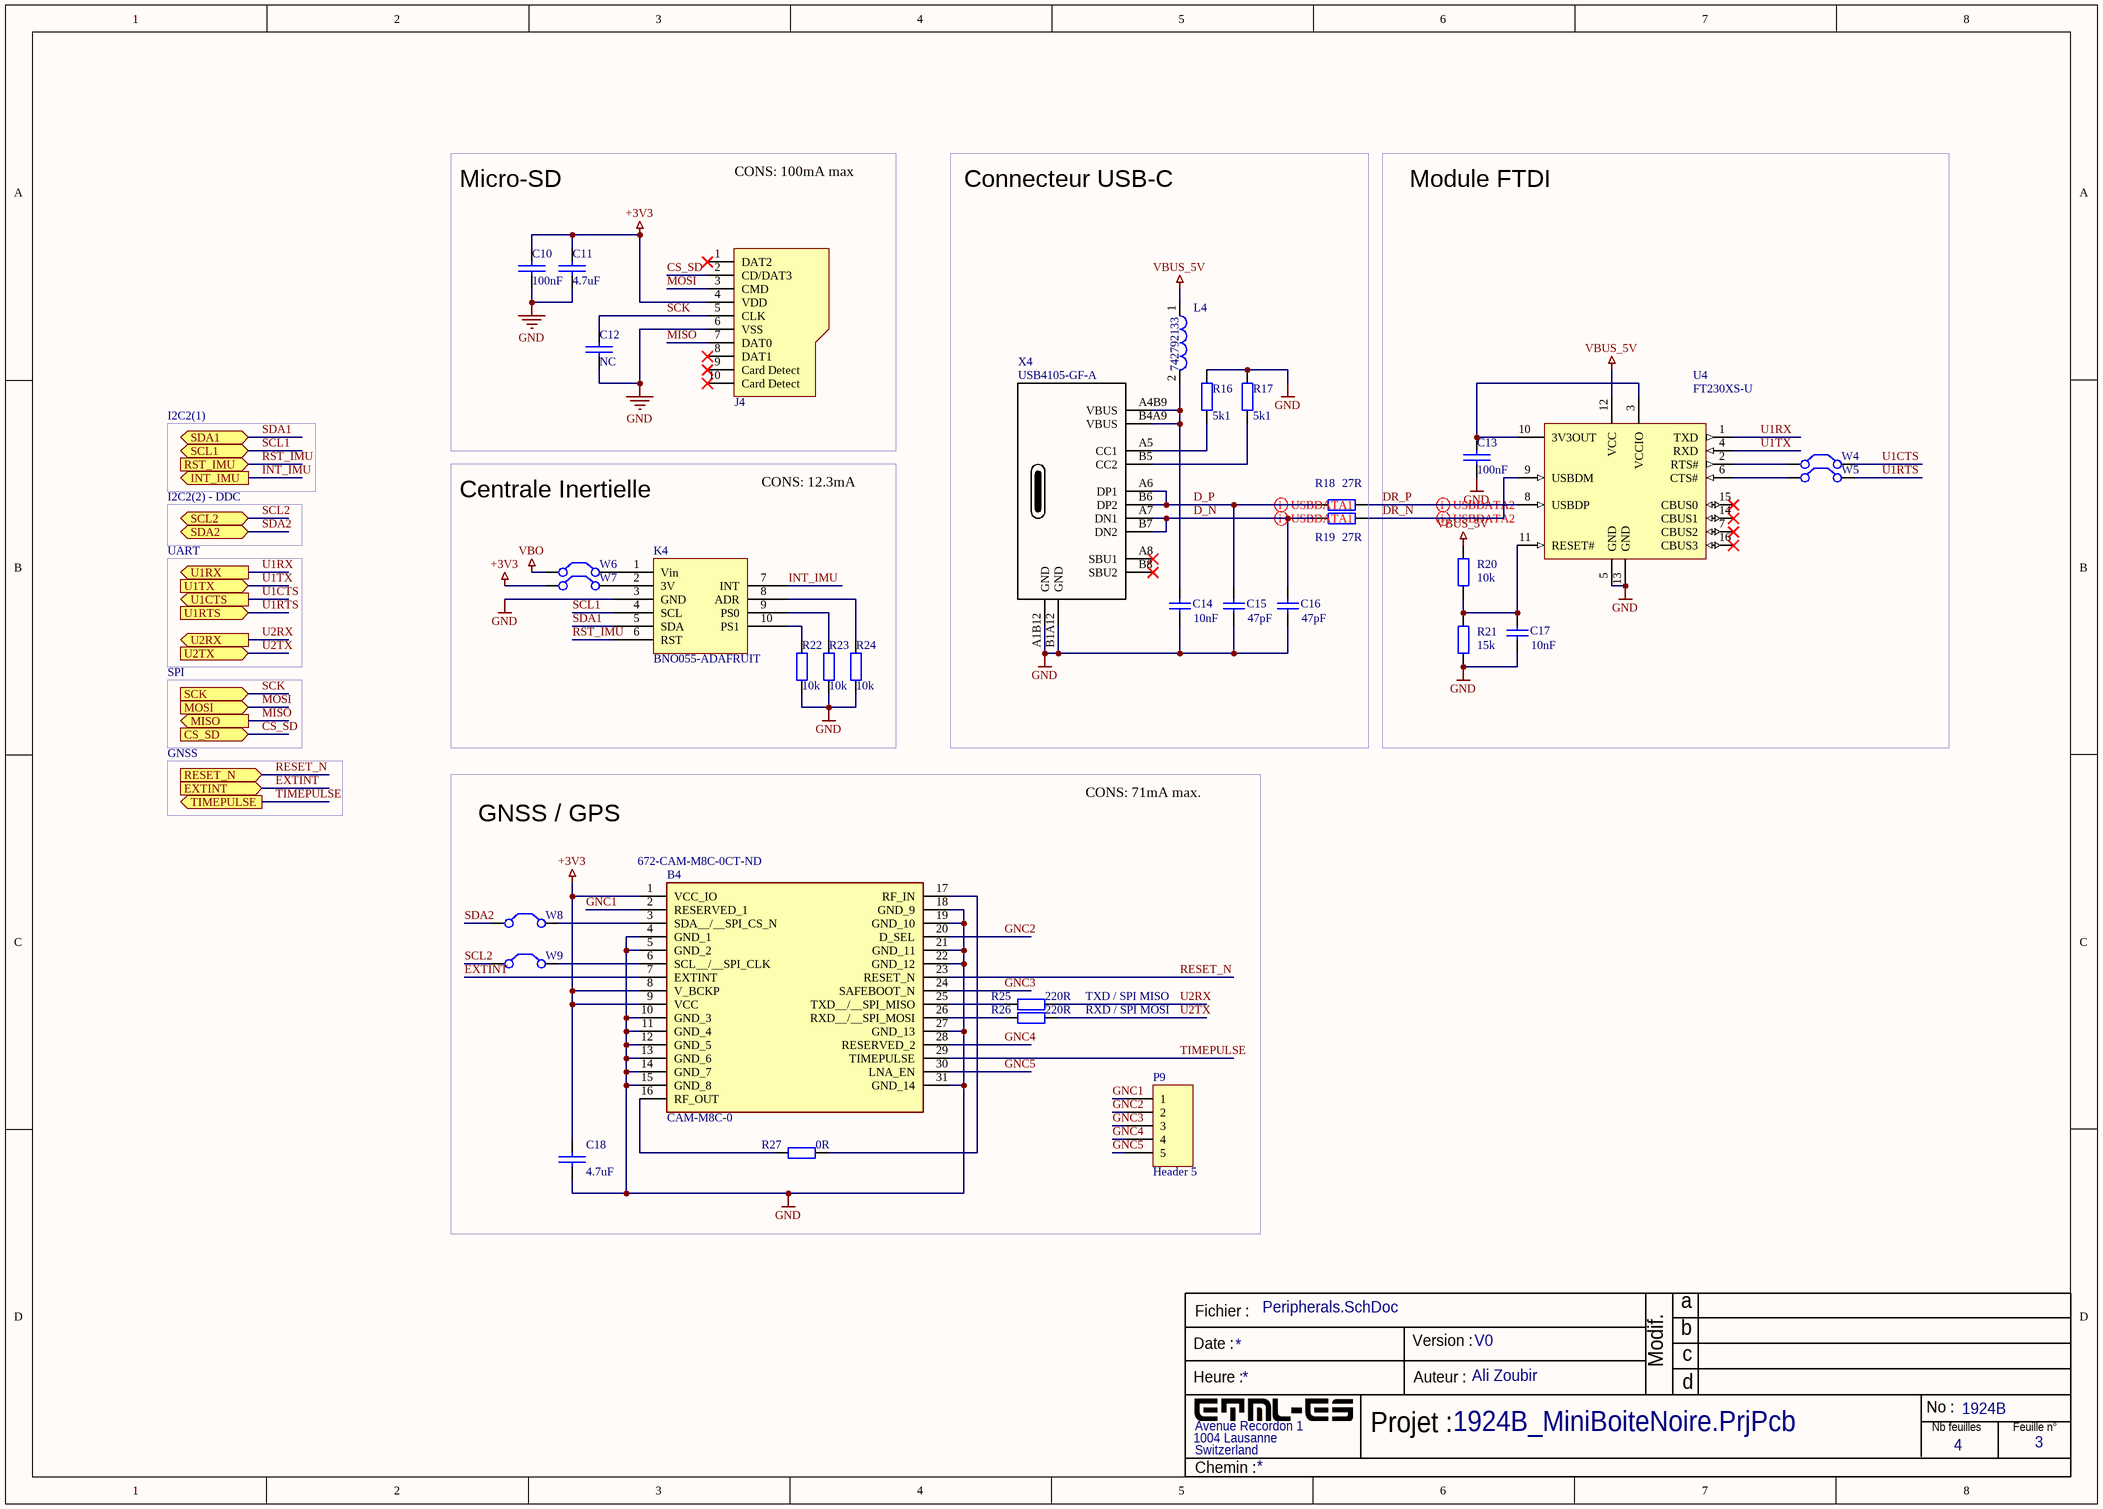
[diagram p3: Peripherals.SchDoc]

### Parts
B4  CAM-M8C-0  Supplier Part Number 1: 672-CAM-M8C-0CT-ND  [CAMM8C0]
C10  100nF  [Cap_0805]
C11  4.7uF  [Cap_0805]
C12  NC  [Cap_0805]
C13  100nF  [Cap_0805]
C14  10nF  [6-0805_L]
C15  47pF  [6-0805_L]
C16  47pF  [6-0805_L]
C17  10nF  [Cap_0805]
C18  4.7uF  [Cap_0805]
J4  693071010811  [uSD-WE-693071010811]  (value not drawn)
K4  BNO055-ADAFRUIT  [BNO055-ADAFRUIT_NO_HOLES]
L4  742792133  [SMD-1206]
P9  Header 5  [HDR1X5]
R16  5k1  [RES_0805]
R17  5k1  [RES_0805]
R18  27R  [RES_0805]
R19  27R  [RES_0805]
R20  10k  [RES_0805]
R21  15k  [RES_0805]
R22  10k  [RES_0805]
R23  10k  [RES_0805]
R24  10k  [RES_0805]
R25  220R  [RES_0805]
R26  220R  [RES_0805]
R27  value 0R  [RES_0805]  (hidden comment: 220R)
U4  FT230XS-U  [SSOP-16_N]
W4  Jumper  [JUMPER]  (value not drawn)
W5  Jumper  [JUMPER]  (value not drawn)
W6  Jumper  [JUMPER]  (value not drawn)
W7  Jumper  [JUMPER]  (value not drawn)
W8  Jumper  [JUMPER]  (value not drawn)
W9  Jumper  [JUMPER]  (value not drawn)
X4  USB4105-GF-A  [GCT_USB4105-GF-A]

### Blocks framed on the sheet
Micro-SD: C10-C12 J4
Connecteur USB-C: C14-C16 L4 R16-R19 X4
Module FTDI: C13 C17 R20 R21 U4 W4 W5
Centrale Inertielle: K4 R22-R24 W6 W7
GNSS / GPS: B4 C18 P9 R25-R27 W8 W9

### Ports
CS_SD (in), EXTINT (in), INT_IMU (out), MISO (out), MOSI (in), RESET_N (in), RST_IMU (in), SCK (in), SCL1 (bidir), SCL2 (bidir), SDA1 (bidir), SDA2 (bidir), TIMEPULSE (out), U1CTS (out), U1RTS (in), U1RX (out), U1TX (in), U2RX (out), U2TX (in)

### Nets
+3V3: B4.1(VCC_IO) B4.8(V_BCKP) B4.9(VCC) C10.1 C11.1 C18.1 J4.4(VDD) W7.1(C1)
GND: B4.4(GND_1) B4.5(GND_2) B4.10(GND_3) B4.11(GND_4) B4.12(GND_5) B4.13(GND_6) B4.14(GND_7) B4.15(GND_8) B4.18(GND_9) B4.19(GND_10) B4.21(GND_11) B4.22(GND_12) B4.27(GND_13) B4.31(GND_14) C10.2 C11.2 C12.2 C13.2 C14.1 C15.1 C16.1 C17.1 C18.2 J4.6(VSS) K4.3(GND) R16.2 R17.2 R21.1 R22.1 R23.1 R24.1 U4.5(GND) U4.13(GND) X4.A1B12(GND) X4.B1A12(GND)
VBO: W6.1(C1)
VBUS_5V: L4.1 R20.2 U4.12(VCC)
CS_SD: J4.2(CD/DAT3) ; port CS_SD
D_N: C16.2 R19.1 X4.A7(DN1) X4.B7(DN2)
D_P: C15.2 R18.1 X4.A6(DP1) X4.B6(DP2)
DR_N: R19.2 U4.9(USBDM)
DR_P: R18.2 U4.8(USBDP)
EXTINT: B4.7(EXTINT) ; port EXTINT
GNC1: B4.2(RESERVED_1) P9.1
GNC2: B4.20(D_SEL) P9.2
GNC3: B4.24(SAFEBOOT_N) P9.3
GNC4: B4.28(RESERVED_2) P9.4
GNC5: B4.30(LNA_EN) P9.5
INT_IMU: K4.7(INT) ; port INT_IMU
MISO: J4.7(DAT0) ; port MISO
MOSI: J4.3(CMD) ; port MOSI
RESET_N: B4.23(RESET_N) ; port RESET_N
RST_IMU: K4.6(RST) ; port RST_IMU
SCK: C12.1 J4.5(CLK) ; port SCK
SCL1: K4.4(SCL) ; port SCL1
SCL2: W9.1(C1) ; port SCL2
SDA1: K4.5(SDA) ; port SDA1
SDA2: W8.1(C1) ; port SDA2
TIMEPULSE: B4.29(TIMEPULSE) ; port TIMEPULSE
U1CTS: W4.2(C2) ; port U1CTS
U1RTS: W5.2(C2) ; port U1RTS
U1RX: U4.1(TXD) ; port U1RX
U1TX: U4.4(RXD) ; port U1TX
U2RX: R25.1 ; port U2RX
U2TX: R26.1 ; port U2TX
NetB4_3: B4.3(SDA__/__SPI_CS_N) W8.2(C2)
NetB4_6: B4.6(SCL__/__SPI_CLK) W9.2(C2)
NetB4_16: B4.16(RF_OUT) R27.2
NetB4_17: B4.17(RF_IN) R27.1
NetB4_25: B4.25(TXD__/__SPI_MISO) R25.2
NetB4_26: B4.26(RXD__/__SPI_MOSI) R26.2
NetC13_1: C13.1 U4.3(VCCIO) U4.10(3V3OUT)
NetC14_2: C14.2 L4.2 X4.A4B9(VBUS) X4.B4A9(VBUS)
NetC17_2: C17.2 R20.1 R21.2 U4.11(RESET#)
NetK4_1: K4.1(Vin) W6.2(C2)
NetK4_2: K4.2(3V) W7.2(C2)
NetK4_8: K4.8(ADR) R24.2
NetK4_9: K4.9(PS0) R23.2
NetK4_10: K4.10(PS1) R22.2
NetR16_1: R16.1 X4.A5(CC1)
NetR17_1: R17.1 X4.B5(CC2)
NetU4_2: U4.2(RTS#) W4.1(C1)
NetU4_6: U4.6(CTS#) W5.1(C1)

Not connected (* = marked no-connect by the designer): J4 1(DAT2)* 8(DAT1)* 9(Card_Detect)* 10(Card_Detect)*; U4 7(CBUS2)* 14(CBUS1)* 15(CBUS0)* 16(CBUS3)*; X4 A8(SBU1)* B8(SBU2)*

### Layout directives
differential pair: D_N, D_P, DR_N, DR_P

### Notes on the sheet
- CONS: 100mA max
- I2C2(1)
- I2C2(2) - DDC
- CONS: 12.3mA
- UART
- SPI
- GNSS
- CONS: 71mA max.
- TXD / SPI MISO
- RXD / SPI MOSI
- Fichier :
- a
- Date :
- Heure :
- Version :
- Auteur :
- Modif.
- b
- c
- d
- Projet :
- No :
- Nb feuilles
- Feuille n°
- Chemin :

### Library data of the parts
B4 = CAM-M8C-0: RF RCVR GNSS/GPS 1.575GHZ MODULE; Manufacturer_Name: U-Blox; Geometry.Height: 2.3mm; Manufacturer_Part_Number: CAM-M8C-0; Mouser Part Number: 377-CAM-M8C-0; Mouser Price/Stock: https://www.mouser.co.uk/ProductDetail/u-blox/CAM-M8C-0?qs=vEM7xhTegWh0Qdx4vzEerw%3D%3D; Arrow Part Number: *; Arrow Price/Stock: *; Datasheet Link: https://www.mouser.cn/ProductDetail/u-blox/CAM-M8C-0?qs=%2Fha2pyFadui7ZmsGRBrJBt%252BuEsnOsR2xV%252BdWTisaE9ttYO2aX8ol3A%3D%3D; Supplier 1: Digi-Key
C10-C13 C18 = C: as C3 on sheet MCU
C14-C17 = Cap: Capacitor; Published: 8-Jun-2000; LatestRevisionDate: 17-Jul-2002; LatestRevisionNote: Re-released for DXP Platform.; PackageReference: RAD-0.3; Publisher: Altium Limited; PackageDescription: Radial Cap, Thru-Hole; 2 Leads; 0.3 in Pin Spacing
  C14 C17: Value: 10nF
  C15 C16: Value: 47pF
J4 = uSD-WE-693071010811: WR-CRD Micro SD Card Connector Push & Push; Manufacturer: Wurth Elektronik; Contact Resistance: 100mOhm; Gender: Socket; Rated Current: 0.5A; Working Voltage: 100VAC; Withstanding Voltage: 500VAC; Manufacturer Part Number: 693071010811; Category: Input/Output Connectors; Match Code: WR-CRD; ComponentLink1Description: Website Link; ComponentLink1URL: https://www.we-online.com/redexpert/article/693071010811?ad; ComponentLink2Description: Datasheet Link; ComponentLink2URL: https://www.we-online.com/redexpert/spec/693071010811?ad; Mount: Surface Mount; Operating Temperature Max: 85°C; Operating Temperature Min: -25°C; Packaging: Tape and Reel; Number of Pins: 8; Type: Push & Push
L4 = CMP-0220-00010-1: SMD EMI Suppression Ferrite Bead WE-CBF, Z = 600 Ohm; Impedance: 600 Ohm; ComponentLink1Description: Manufacturer Link; DatasheetVersion: ver 2, Aug-2007; ComponentLink1URL: http://www.we-online.com; PackageDescription: Chip Inductor, 2-Leads, Body 3.2 x 1.6 mm; ComponentLink2URL: http://www.we-online.de/katalog/media/pdf/742792133.pdf; PackageVersion: 2007; PackageReference: SMD-1206; ComponentLink2Description: Datasheet
P9 = Header 5: Header, 5-Pin; LatestRevisionDate: 17-Jul-2002; LatestRevisionNote: Re-released for DXP Platform.; Publisher: Altium Limited
R16-R27 = Res2: Res 0805; Published: 8-Jun-2000; LatestRevisionDate: 17-Jul-2002; LatestRevisionNote: Re-released for DXP Platform.; PackageReference: AXIAL-0.4; Publisher: Altium Limited; PackageDescription: Axial Device, Thru-Hole; 2 Leads; 0.4 in Pin Spacing
  R16 R17: Value: 5k1
  R18 R19: Value: 27R
  R20 R22-R24: Value: 10k
  R21: Value: 15k
  R25 R26: Value: 220R
U4 = CMP-0248-00025-2: USB to Basic UART Interface Chip, UHCI/OHCI/EHCI Compatible, USB 2.0 Compatible, -40 to +85 degC, 16-Pin SSOP, Pb-Free, Tube; Manufacturer: FTDI; PackageDescription: 16-Pin Small Outline Package, 8.6 x 3.9 mm Body, 0.635 mm Pitch; ComponentLink2URL: http://www.ftdichip.com/Support/Documents/DataSheets/ICs/DS_FT230X.pdf; ComponentLink3URL: www.ftdichip.com/Products/ICs/FT230X.html; PartNumber: FT230XS-U; RevisionNote: DatasheetVersion updated to 1.2 Feb-2013; PackageVersion: Feb-13; ComponentLink2Description: Datasheet; Code_JEDEC: MO-137-AB; DatasheetVersion: ver 1.2, Feb-2013; ComponentLink1URL: http://www.ftdichip.com/; PackageReference: SSOP-16; ComponentLink1Description: Manufacturer URL; ComponentLink3Description: FT230X Product Page
W4-W9 = Jumper: Jumper Wire; Published: 24-Mar-1999; LatestRevisionDate: 17-Jul-2002; LatestRevisionNote: Re-released for DXP Platform.; PackageReference: RAD-0.2; Publisher: Altium Limited; PackageDescription: Radial Cap, Thru-Hole; 2 Leads; 0.2 in Pin Spacing
X4 = USB-C Type 2.0: USB4105-GF-A USB connector; ComponentLink1Description: LCSC  C319148; ComponentLink1URL: https://lcsc.com/product-detail/USB-Connectors_XKB-Connectivity-U262-161N-4BVC11_C319148.html; Supplier 1: LCSC; Supplier Part Number 1: C319148

## Nets that join several sheets
+3V3: SchemaBloc (R1.2 R2.2 R3.2 R4.2), MCU (11 pins), Power (7 pins), Peripherals (8 pins)
GND: MCU (19 pins), Power (28 pins), Peripherals (35 pins)
VBO: Power (7 pins), Peripherals (W6.1)
VBUS_5V: Power (9 pins), Peripherals (L4.1 R20.2 U4.12)
BAT_LVL: MCU (U3.19), Power (R32.1 R33.2)
BAT_READ: MCU (U3.20), Power (R38.1)
BAT_STAT: MCU (U3.30), Power (R28.1 U5.8)
Button_MF: MCU (U3.13), Power (Q11.1 R41.1 R42.2)
CS_SD: MCU (P6.1 U3.12), Peripherals (J4.2)
EXTINT: MCU (U3.34), Peripherals (B4.7)
INT_IMU: MCU (P7.1 U3.36), Power (Q10.1 R44.2), Peripherals (K4.7)
MISO: MCU (P6.2 U3.41), Peripherals (J4.7)
MOSI: MCU (P6.3 U3.11), Peripherals (J4.3)
PWR_HOLD: MCU (U3.31), Power (Q9.1 R43.2)
RESET_N: MCU (U3.15), Peripherals (B4.23)
RST_IMU: MCU (P7.2 U3.38), Peripherals (K4.6)
SCK: MCU (P6.4 U3.14), Peripherals (C12.1 J4.5)
SCL1: SchemaBloc (R4.1), MCU (P7.4 U3.44), Peripherals (K4.4)
SCL2: SchemaBloc (R2.1), MCU (U3.24), Peripherals (W9.1)
SDA1: SchemaBloc (R3.1), MCU (P7.3 U3.1), Peripherals (K4.5)
SDA2: SchemaBloc (R1.1), MCU (U3.23), Peripherals (W8.1)
TIMEPULSE: MCU (U3.33), Peripherals (B4.29)
U1CTS: MCU (P4.3 U3.32), Peripherals (W4.2)
U1RTS: MCU (P4.2 U3.27), Peripherals (W5.2)
U1RX: MCU (P4.1 U3.2), Peripherals (U4.1)
U1TX: MCU (P4.4 U3.43), Peripherals (U4.4)
U2RX: MCU (P5.1 U3.4), Peripherals (R25.1)
U2TX: MCU (P5.2 U3.37), Peripherals (R26.1)